# Altium project smoothieboard-5driver.PrjPcb (part 2 of 2)
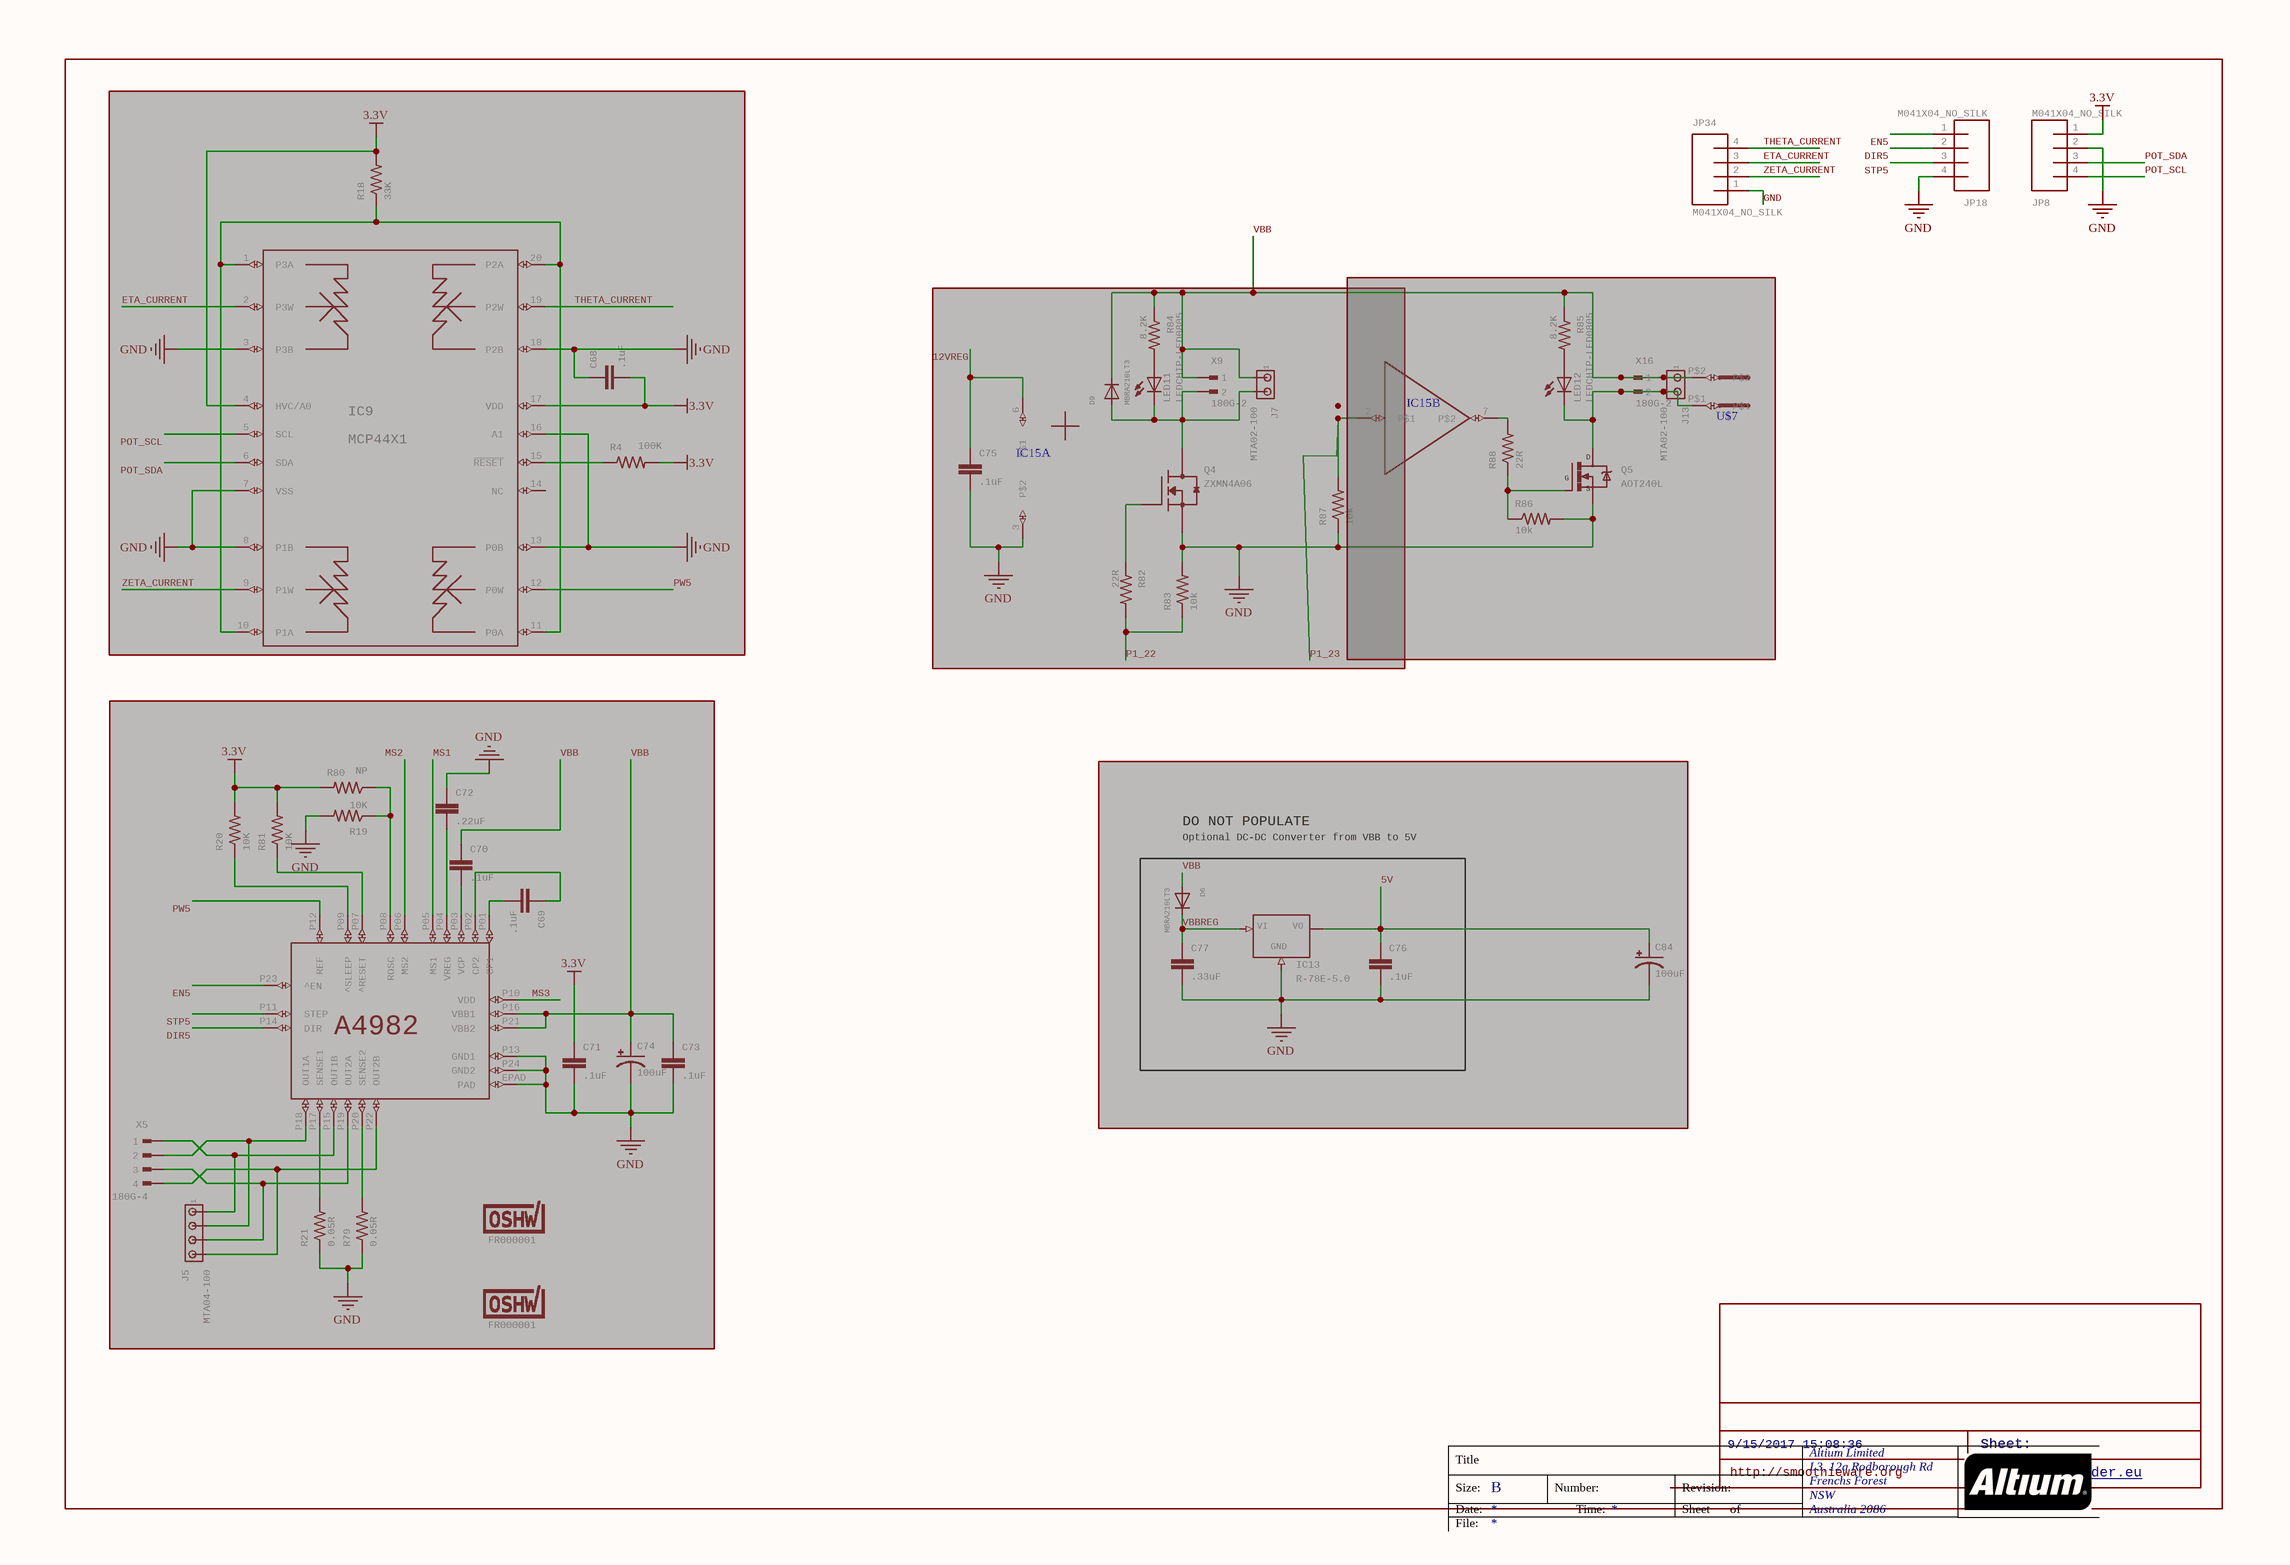
[diagram p5: smoothieboard-5driver_3.SchDoc]

## Nets that join several sheets
3.3V: smoothieboard-5driver_0 (34 pins), smoothieboard-5driver_1 (25 pins), smoothieboard-5driver_2 (12 pins), smoothieboard-5driver_3 (10 pins)
5V: smoothieboard-5driver_0 (SJ1.3 SJ2.3 SJ3.3), smoothieboard-5driver_2 (C64.A D1.C D2.C IC10.3), smoothieboard-5driver_3 (C76.1 C84.+ IC13.3)
GND: smoothieboard-5driver_0 (65 pins), smoothieboard-5driver_1 (57 pins), smoothieboard-5driver_2 (64 pins), smoothieboard-5driver_3 (31 pins)
VUSB: smoothieboard-5driver_0 (X14.VBUS), smoothieboard-5driver_2 (D1.A)
12VREG: smoothieboard-5driver_2 (C62.1 C66.1 IC11.1 IC14.6), smoothieboard-5driver_3 (C75.1 IC15.6)
AVCC: smoothieboard-5driver_0 (C6.1 IC1.10 IC1.12 L1.1), smoothieboard-5driver_1 (5 pins)
DIR1: smoothieboard-5driver_0 (IC1.80 JP7.2), smoothieboard-5driver_1 (IC2.P14)
DIR2: smoothieboard-5driver_0 (IC1.49 JP9.2), smoothieboard-5driver_1 (IC3.P14)
DIR3: smoothieboard-5driver_0 (IC1.58 JP12.2), smoothieboard-5driver_1 (IC5.P14)
DIR4: smoothieboard-5driver_0 (IC1.56 JP15.2), smoothieboard-5driver_1 (IC6.P14)
DIR5: smoothieboard-5driver_0 (IC1.50), smoothieboard-5driver_3 (IC12.P14 JP18.2)
EN1: smoothieboard-5driver_0 (IC1.81 JP7.1), smoothieboard-5driver_1 (IC2.P23)
EN2: smoothieboard-5driver_0 (IC1.48 JP9.1), smoothieboard-5driver_1 (IC3.P23)
EN3: smoothieboard-5driver_0 (IC1.59 JP12.1), smoothieboard-5driver_1 (IC5.P23)
EN4: smoothieboard-5driver_0 (IC1.57 JP15.1), smoothieboard-5driver_1 (IC6.P23)
EN5: smoothieboard-5driver_0 (IC1.85), smoothieboard-5driver_3 (IC12.P23 JP18.1)
ENET_CRS: smoothieboard-5driver_0 (IC1.92), smoothieboard-5driver_2 (R60.2)
ENET_MDC: smoothieboard-5driver_0 (IC1.87), smoothieboard-5driver_2 (IC8.13)
ENET_MDIO: smoothieboard-5driver_0 (IC1.86), smoothieboard-5driver_2 (IC8.12 R52.1)
ENET_REF_CLK: smoothieboard-5driver_0 (IC1.88), smoothieboard-5driver_2 (R51.2)
ENET_RX_ER: smoothieboard-5driver_0 (IC1.89), smoothieboard-5driver_2 (IC8.10 R53.1)
ENET_RXD0: smoothieboard-5driver_0 (IC1.91), smoothieboard-5driver_2 (R58.2)
ENET_RXD1: smoothieboard-5driver_0 (IC1.90), smoothieboard-5driver_2 (R59.2)
ENET_TX_EN: smoothieboard-5driver_0 (IC1.93), smoothieboard-5driver_2 (IC8.16)
ENET_TXD0: smoothieboard-5driver_0 (IC1.95), smoothieboard-5driver_2 (IC8.17)
ENET_TXD1: smoothieboard-5driver_0 (IC1.94), smoothieboard-5driver_2 (IC8.18)
MS1: smoothieboard-5driver_1 (5 pins), smoothieboard-5driver_3 (IC12.P05)
MS2: smoothieboard-5driver_1 (5 pins), smoothieboard-5driver_3 (IC12.P06)
MS3: smoothieboard-5driver_1 (5 pins), smoothieboard-5driver_3 (IC12.P10)
P1_22: smoothieboard-5driver_0 (IC1.36 JP32.1), smoothieboard-5driver_3 (R82.2 R83.1)
P1_23: smoothieboard-5driver_0 (IC1.37 JP32.2), smoothieboard-5driver_3 (IC15.2 R87.2)
P2.6: smoothieboard-5driver_0 (IC1.67 JP33.1), smoothieboard-5driver_2 (R75.2 R76.1)
P2.7: smoothieboard-5driver_0 (IC1.66 JP33.4), smoothieboard-5driver_2 (IC14.4 R72.2)
POT_SCL: smoothieboard-5driver_0 (IC1.47), smoothieboard-5driver_1 (IC4.5 R36.1), smoothieboard-5driver_3 (IC9.5 JP8.4)
POT_SDA: smoothieboard-5driver_0 (IC1.46), smoothieboard-5driver_1 (IC4.6 R35.1), smoothieboard-5driver_3 (IC9.6 JP8.3)
PWM0: smoothieboard-5driver_0 (IC1.69 JP33.2), smoothieboard-5driver_2 (R73.2 R74.1)
PWM1: smoothieboard-5driver_0 (IC1.68 JP33.3), smoothieboard-5driver_2 (IC14.2 R71.2)
RSTOUT: smoothieboard-5driver_0 (IC1.14), smoothieboard-5driver_2 (IC8.15)
STP1: smoothieboard-5driver_0 (IC1.75 JP7.3), smoothieboard-5driver_1 (IC2.P11)
STP2: smoothieboard-5driver_0 (IC1.74 JP9.3), smoothieboard-5driver_1 (IC3.P11)
STP3: smoothieboard-5driver_0 (IC1.73 JP12.3), smoothieboard-5driver_1 (IC5.P11)
STP4: smoothieboard-5driver_0 (IC1.70 JP15.3), smoothieboard-5driver_1 (IC6.P11)
STP5: smoothieboard-5driver_0 (IC1.65), smoothieboard-5driver_3 (IC12.P11 JP18.3)
TH1: smoothieboard-5driver_0 (IC1.9), smoothieboard-5driver_1 (C21.A RN1.8 SL1.2)
TH2: smoothieboard-5driver_0 (IC1.8), smoothieboard-5driver_1 (C22.A RN1.7 SL1.4)
TH3: smoothieboard-5driver_0 (IC1.7), smoothieboard-5driver_1 (C23.A RN1.6 SL1.6)
TH4: smoothieboard-5driver_0 (IC1.6), smoothieboard-5driver_1 (JP13.1 SL1.8)
VBB: smoothieboard-5driver_0 (JP17.1), smoothieboard-5driver_1 (20 pins), smoothieboard-5driver_2 (9 pins), smoothieboard-5driver_3 (14 pins)